# EAGLE design PCB-JOY1 (EAGLE 7.7.0)
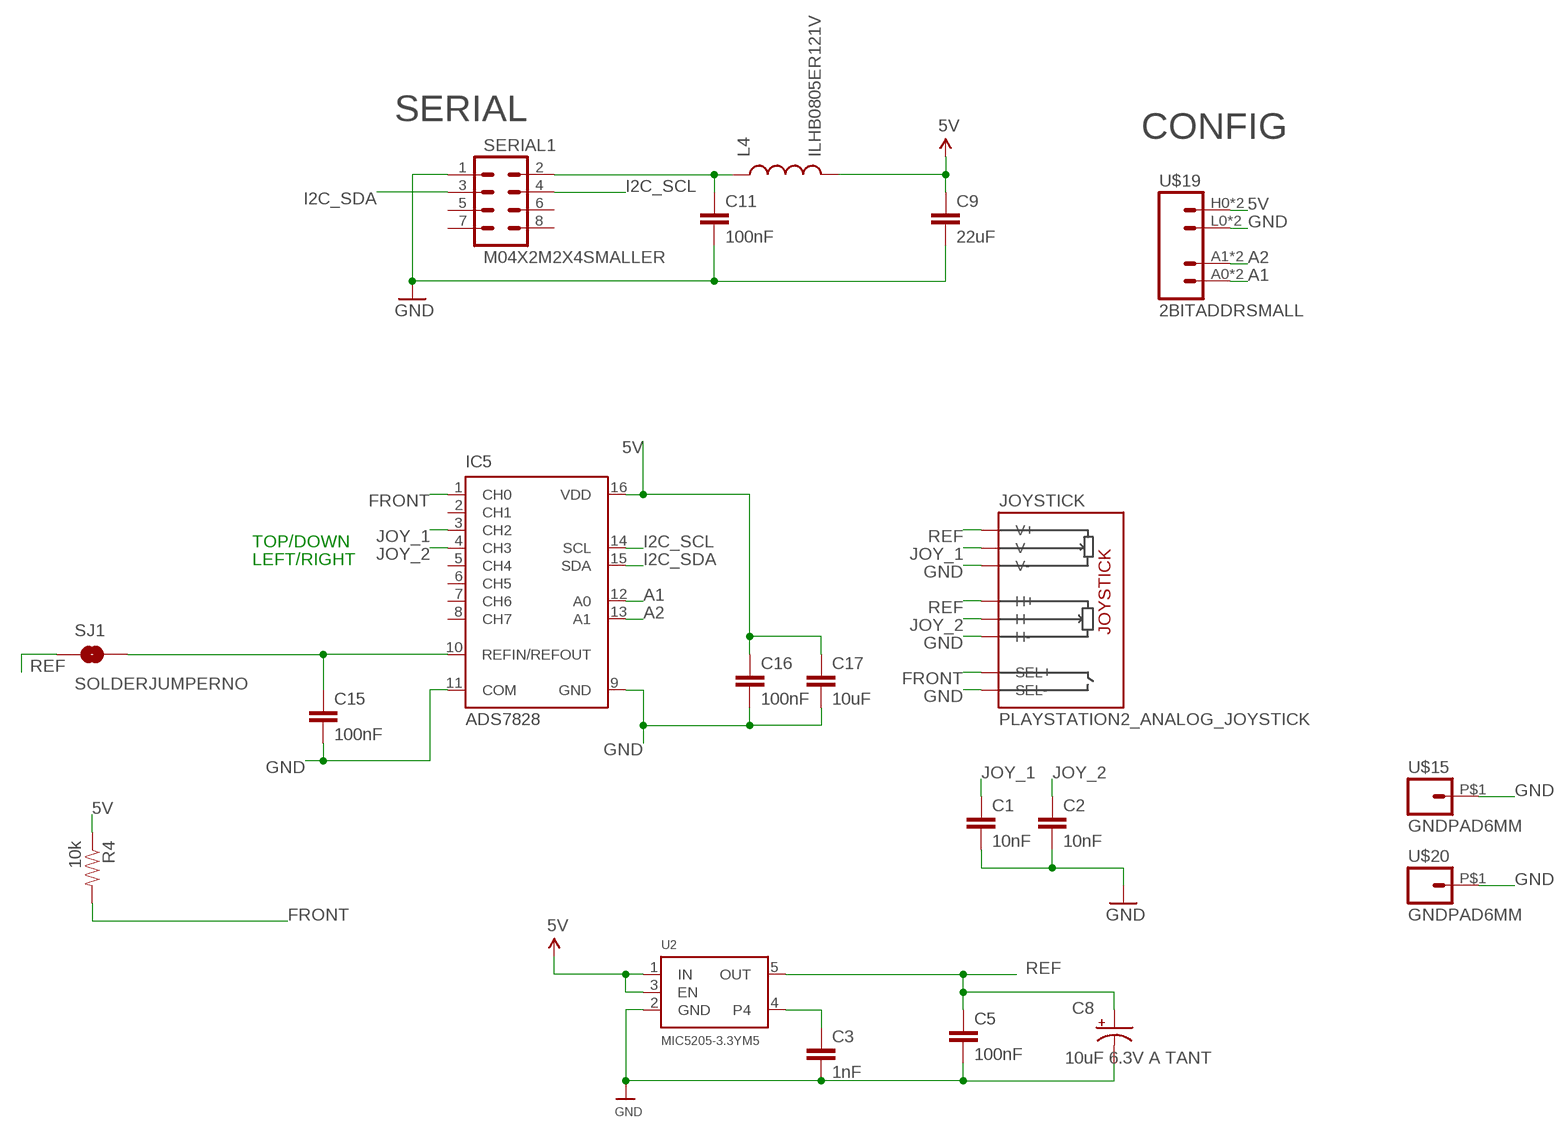
[diagram p0: schematic, sheet 1]

## Parts
C1  10nF  CAP0603-CAP  [0603-CAP]
C2  10nF  CAP0603-CAP  [0603-CAP]
C3  1nF  CAP0603-CAP  [0603-CAP]
C5  100nF  CAP0603-CAP  [0603-CAP]
C8  10uF 6.3V A TANT  CAP_POL1206  [EIA3216]
C9  22uF  CAP0805  [0805]
C11  100nF  CAP0603-CAP  [0603-CAP]
C15  100nF  CAP0603-CAP  [0603-CAP]
C16  100nF  CAP0603-CAP  [0603-CAP]
C17  10uF  CAP0805  [0805]
IC5  ADS7828  [TSSOP16-PW]
JOYSTICK  PLAYSTATION2_ANALOG_JOYSTICK  [PLAYSTATION2_ANALOG_JOYSTICK]
L4  ILHB0805ER121V  INDUCTOR0805  [0805]
R4  10k  RESISTOR0603-RES  [0603-RES]
SERIAL1  M04X2M2X4SMALLER  [M2X4SMALLER]
SJ1  SOLDERJUMPERNO  [SJ_2S-NO]
U2  MIC5205-3.3YM5  VREG_SOT23-5  [SOT23-5]
U$15  GNDPAD6MM  [3.2MMPAD6MM]
U$19  2BITADDRSMALL  [2BITADDR_SMALL]
U$20  GNDPAD6MM  [3.2MMPAD6MM]

## Nets
5V: C9.1 C16.1 C17.1 IC5.16(VDD) L4.2 R4.1 U2.1(IN) U2.3(EN) U$19.H0(VCC) U$19.H1(VCC)
5V_AD [Power]: C15.1 IC5.10(REFIN/REFOUT) SJ1.2
A1: IC5.12(A0) U$19.A0(A1) U$19.AS0(A1)
A2: IC5.13(A1) U$19.A1(A2) U$19.AS1(A2)
FRONT: IC5.1(CH0) JOYSTICK.B1A(SEL+) R4.2
GND: C1.2 C2.2 C3.2 C5.2 C8.C(-) C9.2 C11.2 C15.2 C16.2 C17.2 IC5.9(GND) IC5.11(COM) JOYSTICK.B2A(SEL-) JOYSTICK.H3(H-) JOYSTICK.V3(V-) SERIAL1.1 U2.2(GND) U$15.P$1 U$19.L0(GND) U$19.L1(GND) U$20.P$1
I2C_SCL: IC5.14(SCL) SERIAL1.4
I2C_SDA: IC5.15(SDA) SERIAL1.3
JOY_1: C1.1 IC5.3(CH2) JOYSTICK.V2(V)
JOY_2: C2.1 IC5.4(CH3) JOYSTICK.H2(H)
N$1 [Power]: C11.1 L4.1 SERIAL1.2
N$2: C3.1 U2.4
REF [Power]: C5.1 C8.A(+) JOYSTICK.H1(H+) JOYSTICK.V1(V+) SJ1.1 U2.5(OUT)
Unconnected: IC5.2(CH1) IC5.5(CH4) IC5.6(CH5) IC5.7(CH6) IC5.8(CH7) SERIAL1.5 SERIAL1.6 SERIAL1.7 SERIAL1.8

## Notes on the sheet
- SERIAL
- CONFIG
- TOP/DOWN
- LEFT/RIGHT

## Library data of the parts
C1-C3 C5 C9 C11 C15-C17 = SparkFun:CAP: Capacitor Standard 0603 ceramic capacitor, and 0.1" leaded capacitor.
C8 = freetronics:CAP_POL: Capacitor Polarized These are standard SMD and PTH capacitors. Normally 10uF, 47uF, and 100uF in electrolytic and tantalum varieties. Always verify the external diameter of the through hole cap, it varies with capacity, voltage, and manufacturer. The EIA devices should be standard.
IC5 = burr-brown:ADS7828: 12-Bit, 8-Channel Sampling ANALOG-TO-DIGITAL CONVERTER with I2C? Interface Source: www.ti.com .. ADS7828.pdf; MF: TEXAS INSTRUMENTS; MPN: ADS7828E/250; OC_FARNELL: 1470338; OC_NEWARK: 74C7158
JOYSTICK = SKAARHOJ:PLAYSTATION2_ANALOG_JOYSTICK: Playstation2 Analog Joystick with a Switch
L4 = SparkFun:INDUCTOR: Inductors Basic Inductor/Choke - 0603 and 1206. Footprints are not proven and vary greatly between part numbers.
R4 = SparkFun:RESISTOR: Resistor Basic schematic elements and footprints for 0603, 1206, and PTH resistors.
SERIAL1 = SKAARHOJ:M04X2
SJ1 = SparkFun:SOLDERJUMPER: Solder Jumper Standard SMD solder jumper. Used to automate production. Two varients : Normally Open and Normally Closed are the same, but have different paste layers. NC will have a large amount of paste and should jumper during reflow.
U2 = microbuilder:VREG_SOT23-5: SOT23-5 Fixed Voltage Regulators To better organise some of the SOT23-5 fixed voltage regulators in this library, this new part was created. Part Current Out V Out V In V Dropout Digikey Part No. ADP121 150mA 3.3V 3.4-5.5V 0.09V @ 150mA ADP121-AUJZ33R7CT-ND ADP121 150mA 3.0V 3.1-5.5V 0.09V @ 150mA ADP121-AUJZ30R7CT-ND ADP122 300mA 3.3V 3.4-5.5V 0.085V @ 300mA ADP122AUJZ-3.3-R7CT-ND ADP1712 300mA 3.3V 3.5-5.5V 0.17V @ 300mA ADP1712AUJZ-3.3-R7TR-ND AP7311 (Low Cost) 150mA 3.3V 3.5-6V 0.15V @ 150mA AP7311-33WG-7DICT-ND LD39015M18R 150mA 1.8V 1.9V-5.5V 0.08V @ 100mA 497-6977-1-ND MCP1824T-3302E/OT 300mA 3.3V 3.5V-6V 0.2V @ 300mA MCP1824T-3302E/OTCT-ND MIC5205-2.5YM5 TR 150mA 2.5V 2.7-16V 0.165V @ 150mA 576-1257-2-ND MIC5205-3.0YM5 TR 150mA 3.0V 3.2V-16V 0.165V @ 150mA 576-1258-2-ND MIC5205-3.3YM5 TR 150mA 3.3V 3.5V-16V 0.165V @ 150mA 576-1259-2-ND TPS780330220 150mA 3.3V+2.2V 3.6-5.5V 250mV Max 296-23332-1-ND TDA3663/N1,135 100mA 3.3V 3.5-45V 0.18V @ 50mA 568-5343-1-ND
U$15 U$20 = SKAARHOJ:GNDPAD
U$19 = SKAARHOJ:2BITADDR

## Net classes
0 default: width 0.203 mm, drill 0.406 mm, clearance 0.203 mm
1 Power: width 0.406 mm, drill 0.61 mm, clearance 0.203 mm

## Board
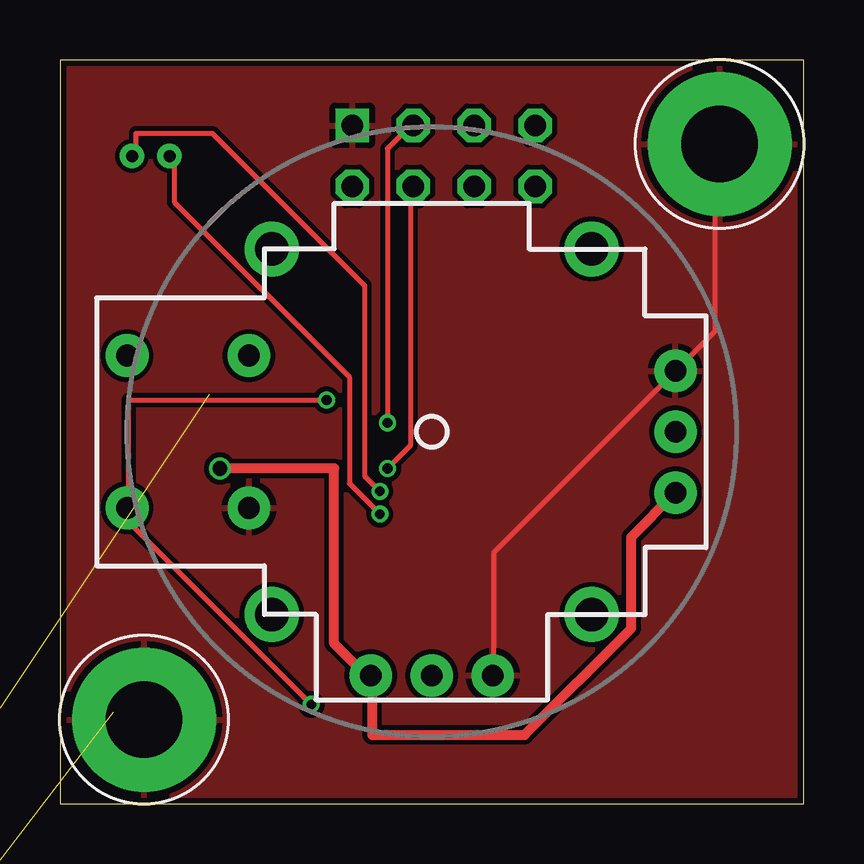
[diagram p1: board, top side]
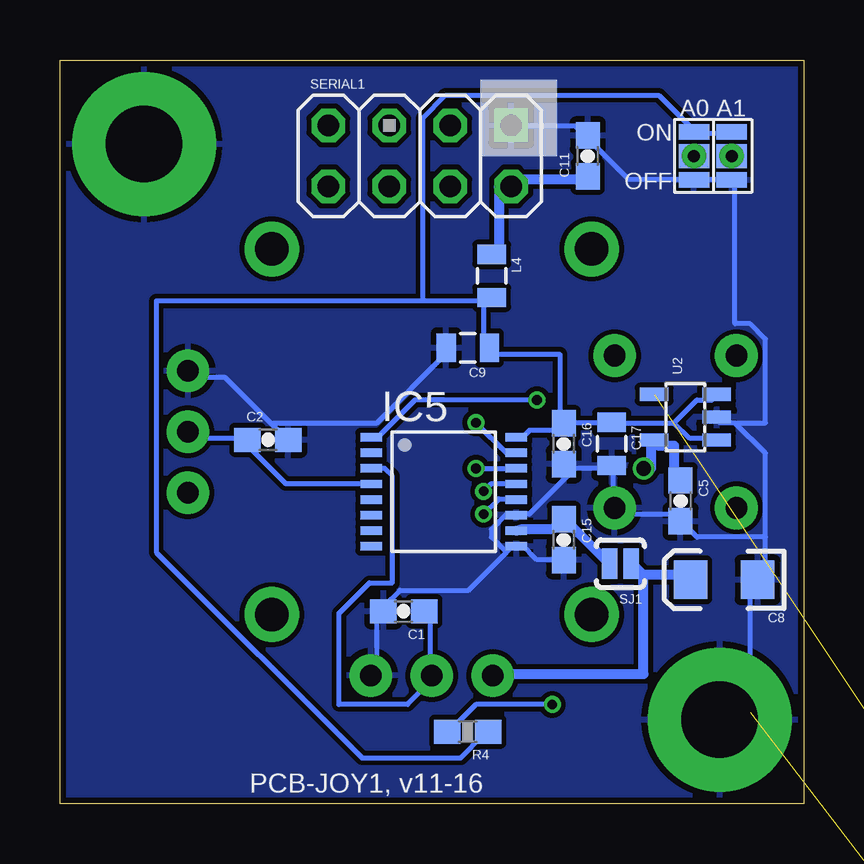
[diagram p2: board, bottom side, seen from below]

Size 31 x 31 mm. Coordinates in mm from the lower left corner, seen from the top.
Outline: 0,0 31,0 31,31 0,31 0,0
Copper layers (1*16): Top 0.035mm / dielectric 1.5mm / Bottom 0.035mm
Design rules "Fusion_eagle_rule_v1.1": minimum track width 6mil, minimum drill 12mil, track to track 6mil, track to pad 6mil, pad to pad 6mil, via to via 6mil, smd to smd 0mil, copper to edge 10mil, drill to drill 10mil, minimum pad ring 10mil, minimum via ring 6mil, stop-mask expansion 2mil, vias tented up to drill 100mil, thermal gap 10mil

### Footprints (pad centres in the part's own frame; a part is rotated, then mirrored left to right if it is on the bottom)
0603-CAP = smd 1.1 x 1: 1 -0.85,0; 2 0.85,0
EIA3216 = smd 1.4 x 1.6: A 1.4,0; C -1.4,0
0805 = smd 0.8 x 1.2: 1 -0.9,0; 2 0.9,0
TSSOP16-PW = smd 0.35 x 0.9: 1 -2.275,-3.025; 2 -1.625,-3.025; 3 -0.975,-3.025; 4 -0.325,-3.025; 5 0.325,-3.025; 6 0.975,-3.025; 7 1.625,-3.025; 8 2.275,-3.025; 9 2.275,3.025; 10 1.625,3.025; 11 0.975,3.025; 12 0.325,3.025; 13 -0.325,3.025; 14 -0.975,3.025; 15 -1.625,3.025; 16 -2.275,3.025
PLAYSTATION2_ANALOG_JOYSTICK = drill 0.9 pad 1.778: B1A -3.175,12.7; B1B 3.175,12.7; B2A -3.175,7.62; B2B 3.175,7.62 | drill 0.889 pad 1.778: H1 -2.54,-10.16; H2 0,-10.16; H3 2.54,-10.16; V1 -10.16,2.54; V2 -10.16,0; V3 -10.16,-2.54 | drill 1.397 pad 2.286: MOUNT1 -7.62,6.668; MOUNT2 -7.62,-6.668; MOUNT3 7.62,-6.668; MOUNT4 7.62,6.668
0603-RES = smd 1.1 x 1: 1 -0.85,0; 2 0.85,0
M2X4SMALLER = drill 0.9 square: 1 -1.27,3.81 | drill 0.9 octagon: 2 1.27,3.81; 3 -1.27,1.27; 4 1.27,1.27; 5 -1.27,-1.27; 6 1.27,-1.27; 7 -1.27,-3.81; 8 1.27,-3.81
SJ_2S-NO = smd 0.635 x 1.27: 1 -0.45,0; 2 0.45,0
SOT23-5 = smd 0.55 x 1.2: 1 -0.95,-1.3; 2 0,-1.3; 3 0.95,-1.3; 4 0.95,1.3; 5 -0.95,1.3
3.2MMPAD6MM = drill 3.2 pad 6: P$1 0,0
2BITADDR_SMALL = drill 0.5: A0 -1.565,0; A1 0,0 | smd 1.27 x 1: AS0 -1.565,0; AS1 0,0 | smd 1.27 x 0.635: H0 -1.565,1; H1 0,1; L0 -1.565,-1; L1 0,-1

### Placement (x,y rotation side)
C1  16.67,8.02 180 bottom
C2  22.33,15.16 0 bottom
C3  -23,-28 0 top  (outside the outline)
C5  5.13,12.62 270 bottom
C8  3.31,9.33 180 bottom
C9  14,19 180 bottom
C11  9,27 90 bottom
C15  10,11 270 bottom
C16  10,15 270 bottom
C17  8,15 270 bottom
IC5  15,13 270 bottom
JOYSTICK  15.5,15.5 90 top
L4  13,22 270 bottom
R4  14,3 180 bottom
SERIAL1  16,27 270 bottom
SJ1  7.63,10 180 bottom
U2  4.92,16.11 90 bottom
U$15  3.5,3.5 0 top
U$19  3,27 0 bottom
U$20  27.5,27.5 0 top

### Tracks (layer width: path | path; a pad name or v marks a point on that pad's centre or on a via)
5V
  Bottom 0.203: IC5.16 11.75,15.24 11.43,15.56 10.16,15.56 C16.1 | 5.4,15.88 4.76,15.24 3.81,15.24 U2.1 | 5.4,15.88 7.94,15.88 C17.1 8.26,15.88 9.84,15.88 C16.1 | 5.4,15.88 4.45,16.83 3.81,16.83 U2.3 | U$19.H1 3.17,27.94 4.45,27.94 U$19.H0 4.76,28.26 6.03,29.53 14.92,29.53 15.88,28.57 15.88,20.95 | 13.34,20.95 13.02,20.95 L4.2 13.34,20.95 | 13.34,20.95 15.88,20.95 | 15.88,20.95 26.99,20.95 26.99,10.48 18.41,1.91 14.29,1.91 13.34,2.86 R4.1 | 13.34,20.95 13.34,19.05 C9.1 13.02,18.73 10.16,18.73 10.16,15.88 C16.1
5V_AD
  Bottom 0.406: IC5.10 11.75,11.43 10.48,11.43 10.16,11.75 C15.1 9.84,11.75 8.26,10.16 SJ1.2
A1  (via drill 0.41)
  Top 0.203: v13.34,12.06 12.06,13.34 12.06,17.78 4.76,25.08 4.76,26.99 U$19.AS0
  Bottom 0.203: v13.34,12.06 12.7,12.7 12.06,12.7 IC5.12 | 4.76,26.99 U$19.AS0
A2  (via drill 0.41)
  Top 0.203: v13.34,13.02 12.7,13.65 12.7,21.59 6.35,27.94 3.17,27.94 3.17,27.3 U$19.AS1
  Bottom 0.203: v13.34,13.02 13.02,13.34 12.06,13.34 IC5.13 | 3.17,26.99 U$19.AS1
FRONT  (via drill 0.41)
  Top 0.203: v11.11,16.83 2.86,16.83 2.86,12.38 JOYSTICK.B1A 2.86,12.06 2.86,11.75 v10.48,4.13
  Bottom 0.203: v11.11,16.83 16.19,16.83 17.78,15.24 IC5.1 | v10.48,4.13 13.65,4.13 14.61,3.17 R4.2
GND  (1 unrouted)
  Top 0.203: U$20.P$1 27.3,27.3 27.3,19.68 JOYSTICK.H3 18.1,10.48 18.1,5.4 JOYSTICK.V3
  Bottom 0.203: 22.23,15.88 24.13,17.78 25.4,17.78 JOYSTICK.H3 | 22.23,15.88 21.59,15.24 C2.2 | 22.23,15.88 17.78,15.88 14.92,18.73 C9.2 | C15.2 10.16,10.16 11.11,10.16 11.75,10.79 IC5.9 12.06,10.79 12.38,10.48 | JOYSTICK.V3 17.78,5.4 17.78,7.94 C1.2 17.46,8.26 16.83,8.89 13.97,8.89 12.38,10.48 | SERIAL1.1 12.06,28.26 9.53,28.26 9.21,27.94 C11.2 8.89,27.62 7.3,26.04 4.76,26.04 U$19.L0 4.45,26.04 3.17,26.04 U$19.L1 2.86,25.72 2.86,20 2.22,20 1.59,19.37 1.59,15.88 2.86,15.88 | 9.53,13.97 11.43,12.06 11.75,12.06 IC5.11 12.06,12.06 12.38,12.06 13.02,11.43 13.02,11.11 12.38,10.48 | 9.53,13.97 8.26,13.97 C17.2 7.94,13.97 7.94,12.38 JOYSTICK.B2A 7.62,12.06 5.4,12.06 C5.2 5.08,11.75 4.45,11.11 1.59,11.11 | 9.53,13.97 9.84,13.97 C16.2 | 2.86,15.88 3.49,15.88 U2.2 | 2.86,15.88 1.59,14.61 1.59,11.11 | 1.59,11.11 1.59,9.53 1.91,9.53 C8.C 2.22,9.21 2.22,3.81 3.49,3.81 U$15.P$1
  pour Top: 0,0 31,0 31,31 0,31
  pour Bottom: 0,0 31,0 31,31 0,31
I2C_SCL  (via drill 0.41)
  Top 0.203: v13.65,13.97 14.61,14.92 14.61,25.72 SERIAL1.4
  Bottom 0.203: v13.65,13.97 12.06,13.97 IC5.14
I2C_SDA  (via drill 0.41)
  Top 0.203: v13.65,15.88 13.65,27.3 14.61,28.26 SERIAL1.3
  Bottom 0.203: v13.65,15.88 12.38,14.61 12.06,14.61 IC5.15
JOY_1
  Bottom 0.203: IC5.3 17.78,13.97 17.46,13.97 17.14,13.65 17.14,9.21 18.1,9.21 19.37,7.94 19.37,4.13 16.51,4.13 15.56,5.08 JOYSTICK.V2 15.56,5.4 15.56,7.94 C1.1
JOY_2
  Bottom 0.203: IC5.4 18.1,13.34 21.59,13.34 23.18,14.92 C2.1 23.5,15.24 25.4,15.24 JOYSTICK.H2
N$1
  Bottom 0.406: C11.1 9.21,26.04 12.06,26.04 SERIAL1.2 12.38,25.72 12.7,25.72 12.7,23.18 L4.1
N$2  (1 unrouted)
REF  (via drill 0.61)
  Top 0.406: v6.67,13.97 11.43,13.97 11.43,6.67 12.7,5.4 JOYSTICK.V1 13.02,5.08 13.02,2.86 19.37,2.86 23.81,7.3 23.81,11.11 JOYSTICK.H1
  Bottom 0.406: 6.67,9.53 6.99,9.84 SJ1.1 | 6.67,9.53 4.76,9.53 C8.A | C5.1 5.4,13.65 5.4,14.92 6.03,14.92 U2.5 6.35,14.92 6.35,13.97 v6.67,13.97 | 6.67,9.53 6.67,5.4 12.7,5.4 JOYSTICK.V1

### Text on the board
_bsilk: PCB-JOY1, v11-16